# Altium schematic sheet Walrus Main.SchDoc: Main
size B; PageSetup: Record=PageOptions|CenterHorizontal=True|CenterVertical=True|PrintScale=1.05|XCorrection=1.00|YCorrection=1.00|PrintKind=2|BorderSize=5000000|LeftOffset=0|BottomOffset=0|Orientation=2|PaperLength=1000|PaperWidth=1000|Scale=100|PaperSource=7|PrintQuality=-4|MediaType=1|DitherType=10|PaperKind=Letter|PrintScaleMode=1; Organization: Morewood Design Labs, Inc.; Address1: 5001 Baum Blvd.; Address2: Suite 675; Address3: Pittsburgh, PA 15213; Address4: 412-687-1110; SheetNumber: 3; SheetTotal: 4; Client: Test; Project: {ENTER PROJECT}; MdlPcbNumber: Test; ClientPcbNumber: Test; ClientPcbaNumber: Test; ClientPcbaRev: Test; ClientPcbRev: Test; ProjectName: Walrus
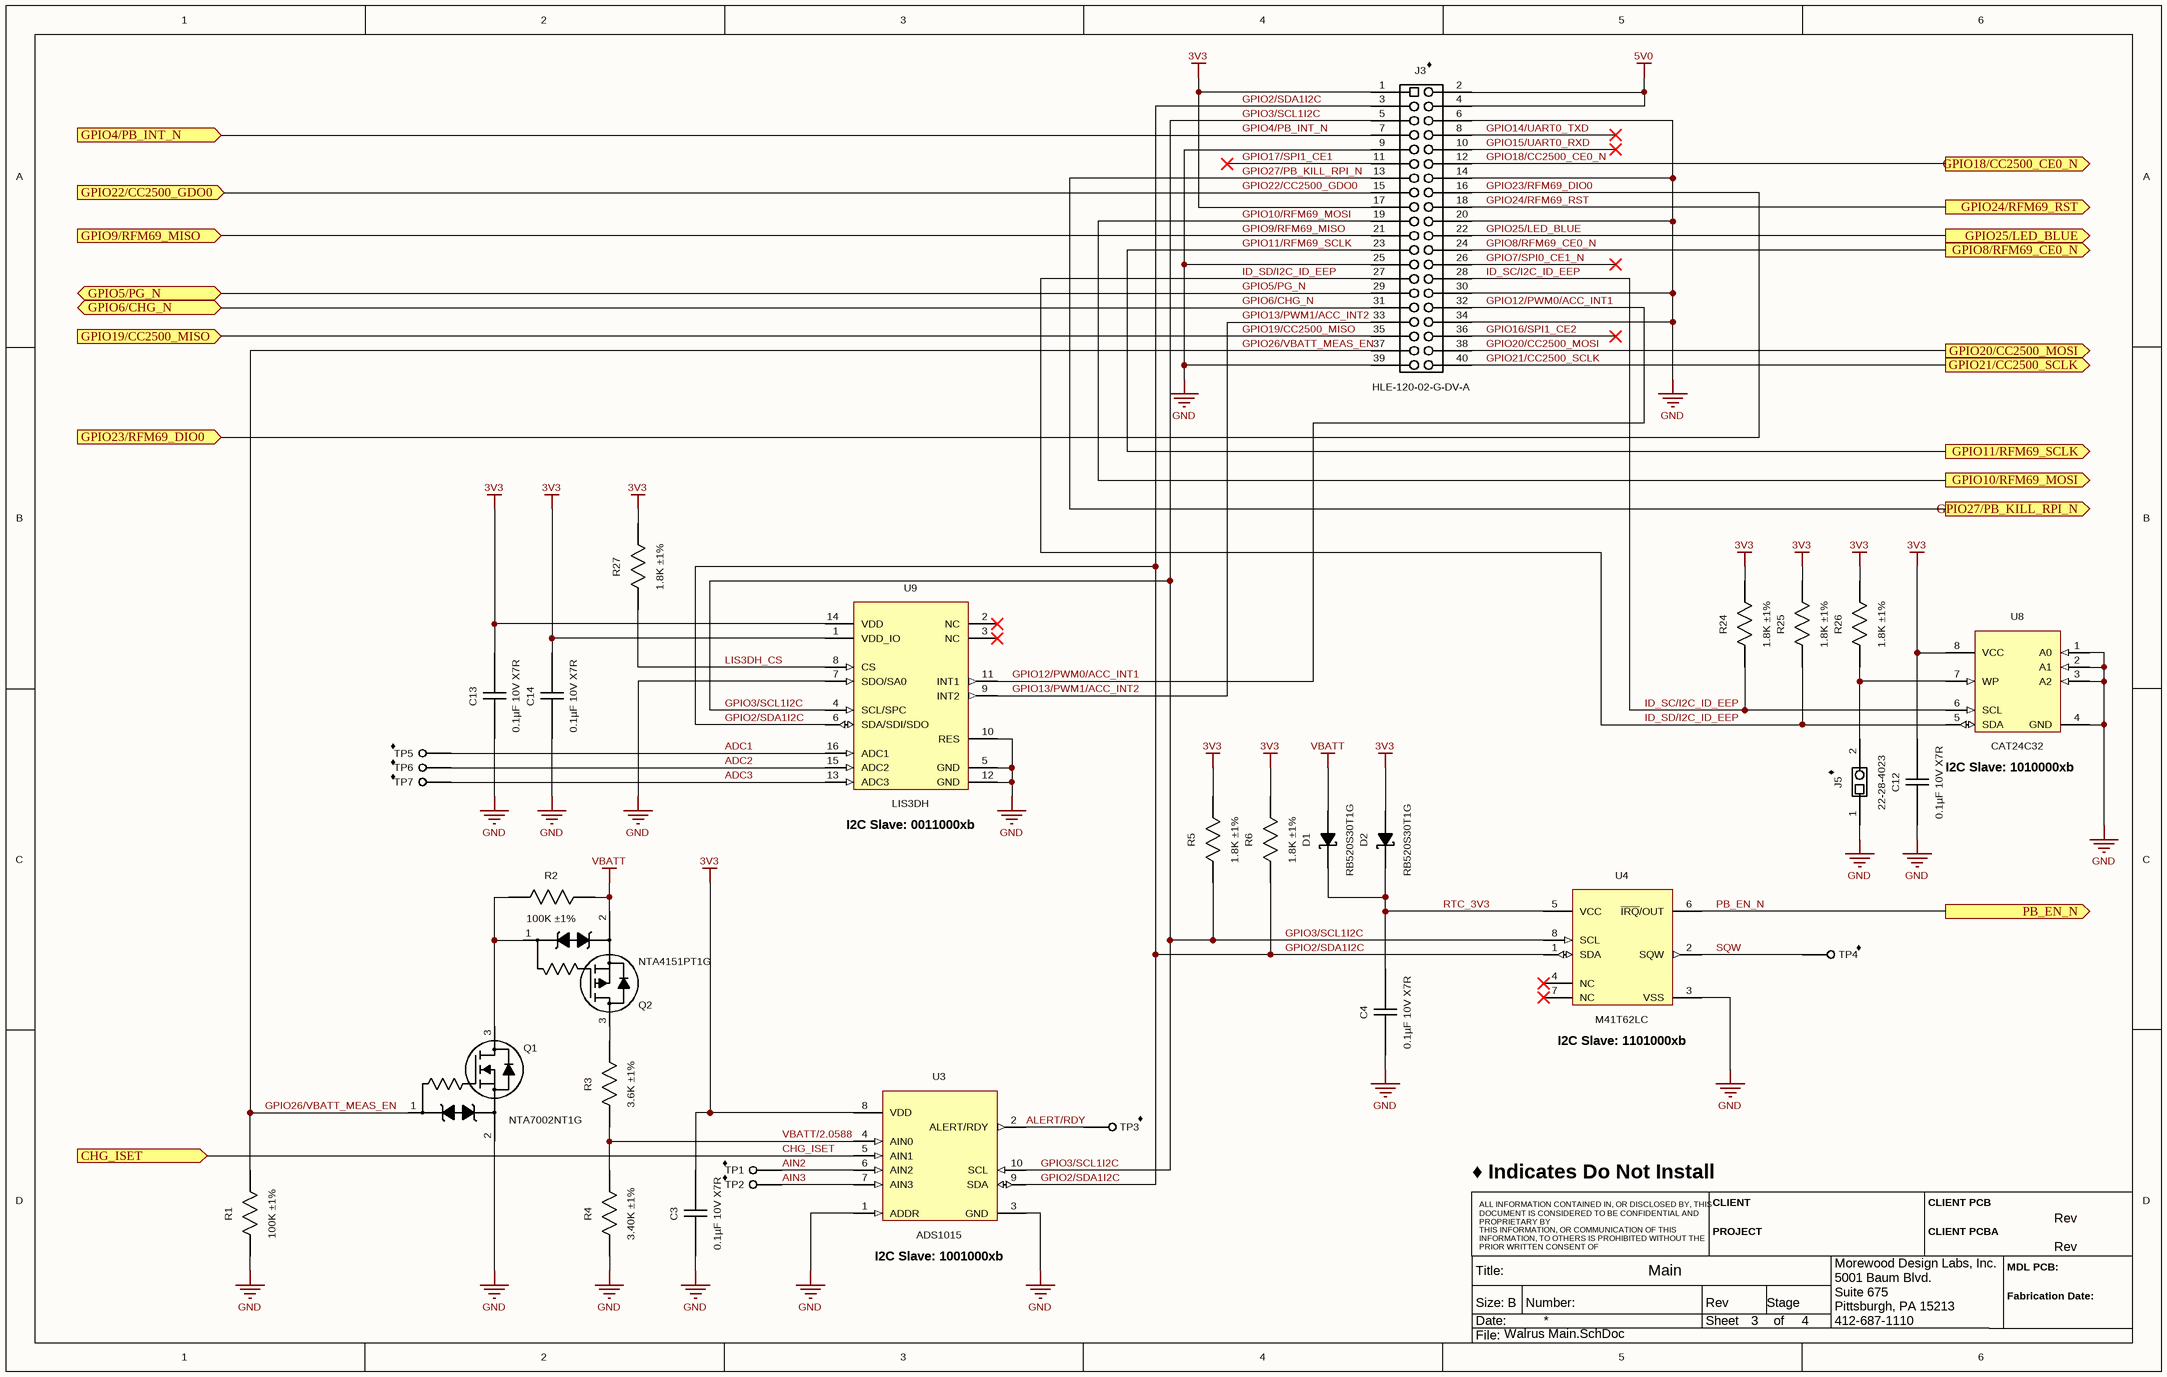
[diagram p0: Walrus Main.SchDoc]

## Parts
C3  0.1µF 10V X7R  [CAPC1005X60L(0402_FLEXTRONICS)]
C4  0.1µF 10V X7R  [CAPC1005X60L(0402_FLEXTRONICS)]
C12  0.1µF 10V X7R  [CAPC1005X60L(0402_FLEXTRONICS)]
C13  0.1µF 10V X7R  [CAPC1005X60L(0402_FLEXTRONICS)]
C14  0.1µF 10V X7R  [CAPC1005X60L(0402_FLEXTRONICS)]
D1  RB520S30T1G  [SODFL1608X70L(SOD-523)]
D2  RB520S30T1G  [SODFL1608X70L(SOD-523)]
J3  HLE-120-02-G-DV-A  DNI: ♦  [SAMTEC_HLE-120-02-G-DV-A]
J5  22-28-4023  DNI: ♦  [MOLEX_22-28-4023]
Q1  NTA7002NT1G  [SOT50P160X90-3L(SOT416, SC75)]
Q2  NTA4151PT1G  [SOT50P160X90-3L(SOT416, SC75)]
R1  100K ±1%  [RESC1005X40L(0402)]
R2  100K ±1%  [RESC1005X40L(0402)]
R3  3.6K ±1%  [RESC1005X40L(0402)]
R4  3.40K ±1%  [RESC1005X40L(0402)]
R5  1.8K ±1%  [RESC1005X40L(0402)]
R6  1.8K ±1%  [RESC1005X40L(0402)]
R24  1.8K ±1%  [RESC1005X40L(0402)]
R25  1.8K ±1%  [RESC1005X40L(0402)]
R26  1.8K ±1%  [RESC1005X40L(0402)]
R27  1.8K ±1%  [RESC1005X40L(0402)]
TP1  DNI: ♦  [TP100P50D]  (hidden comment: Test Point, Through Hole, 1.0mm Pad, 0.5mm Hole)
TP2  DNI: ♦  [TP100P50D]  (hidden comment: Test Point, Through Hole, 1.0mm Pad, 0.5mm Hole)
TP3  DNI: ♦  [TP100P50D]  (hidden comment: Test Point, Through Hole, 1.0mm Pad, 0.5mm Hole)
TP4  DNI: ♦  [TP100P50D]  (hidden comment: Test Point, Through Hole, 1.0mm Pad, 0.5mm Hole)
TP5  DNI: ♦  [TP100P50D]  (hidden comment: Test Point, Through Hole, 1.0mm Pad, 0.5mm Hole)
TP6  DNI: ♦  [TP100P50D]  (hidden comment: Test Point, Through Hole, 1.0mm Pad, 0.5mm Hole)
TP7  DNI: ♦  [TP100P50D]  (hidden comment: Test Point, Through Hole, 1.0mm Pad, 0.5mm Hole)
U3  ADS1015  [QFN50P200X150X40-10(RUG_R-PQFP-N10)]
U4  M41T62LC  [LCC90P320X150X80-8N(M41T62)]
U8  CAT24C32  [SON50P300X200X55-8L(UDFN-8)]
U9  LIS3DH  [LGA50P300X300X100-16N(LGA16)]

## Ports
CHG_ISET (in), GPIO4/PB_INT_N (in), GPIO5/PG_N (bidir), GPIO6/CHG_N (bidir), GPIO8/RFM69_CE0_N (out), GPIO9/RFM69_MISO (in), GPIO10/RFM69_MOSI (out), GPIO11/RFM69_SCLK (out), GPIO18/CC2500_CE0_N (out), GPIO19/CC2500_MISO (in), GPIO20/CC2500_MOSI (out), GPIO21/CC2500_SCLK (out), GPIO22/CC2500_GDO0 (in), GPIO23/RFM69_DIO0 (in), GPIO24/RFM69_RST (out), GPIO25/LED_BLUE (out), GPIO27/PB_KILL_RPI_N (out), PB_EN_N (out)

## Nets
3V3: C3.2 C12.2 C13.2 C14.2 D2.2(A) J3.1 J3.17 R5.2 R6.2 R24.2 R25.2 R26.2 R27.2 U3.8(VDD) U8.8(VCC) U9.1(VDD_IO) U9.14(VDD)
5V0: J3.2 J3.4
GND: C3.1 C4.1 C12.1 C13.1 C14.1 J3.6 J3.9 J3.14 J3.20 J3.25 J3.30 J3.34 J3.39 J5.1 Q1.2(S) R1.1 R4.1 U3.1(ADDR) U3.3(GND) U4.3(VSS) U8.1(A0) U8.2(A1) U8.3(A2) U8.4(GND) U9.5(GND) U9.7(SDO/SA0) U9.10(RES) U9.12(GND)
VBATT: D1.2(A) Q2.2(S) R2.2
ADC1: TP5.1 U9.16(ADC1)
ADC2: TP6.1 U9.15(ADC2)
ADC3: TP7.1 U9.13(ADC3)
AIN2: TP1.1 U3.6(AIN2)
AIN3: TP2.1 U3.7(AIN3)
ALERT/RDY: TP3.1 U3.2(ALERT/RDY)
CHG_ISET: U3.5(AIN1) ; port CHG_ISET
GPIO2/SDA1I2C: J3.3 R6.1 U3.9(SDA) U4.1(SDA) U9.6(SDA/SDI/SDO)
GPIO3/SCL1I2C: J3.5 R5.1 U3.10(SCL) U4.8(SCL) U9.4(SCL/SPC)
GPIO4/PB_INT_N: J3.7 ; port GPIO4/PB_INT_N
GPIO5/PG_N: J3.29 ; port GPIO5/PG_N
GPIO6/CHG_N: J3.31 ; port GPIO6/CHG_N
GPIO7/SPI0_CE1_N: J3.26
GPIO8/RFM69_CE0_N: J3.24 ; port GPIO8/RFM69_CE0_N
GPIO9/RFM69_MISO: J3.21 ; port GPIO9/RFM69_MISO
GPIO10/RFM69_MOSI: J3.19 ; port GPIO10/RFM69_MOSI
GPIO11/RFM69_SCLK: J3.23 ; port GPIO11/RFM69_SCLK
GPIO12/PWM0/ACC_INT1: J3.32 U9.11(INT1)
GPIO13/PWM1/ACC_INT2: J3.33 U9.9(INT2)
GPIO14/UART0_TXD: J3.8
GPIO15/UART0_RXD: J3.10
GPIO16/SPI1_CE2: J3.36
GPIO17/SPI1_CE1: J3.11
GPIO18/CC2500_CE0_N: J3.12 ; port GPIO18/CC2500_CE0_N
GPIO19/CC2500_MISO: J3.35 ; port GPIO19/CC2500_MISO
GPIO20/CC2500_MOSI: J3.38 ; port GPIO20/CC2500_MOSI
GPIO21/CC2500_SCLK: J3.40 ; port GPIO21/CC2500_SCLK
GPIO22/CC2500_GDO0: J3.15 ; port GPIO22/CC2500_GDO0
GPIO23/RFM69_DIO0: J3.16 ; port GPIO23/RFM69_DIO0
GPIO24/RFM69_RST: J3.18 ; port GPIO24/RFM69_RST
GPIO25/LED_BLUE: J3.22 ; port GPIO25/LED_BLUE
GPIO26/VBATT_MEAS_EN: J3.37 Q1.1(G) R1.2
GPIO27/PB_KILL_RPI_N: J3.13 ; port GPIO27/PB_KILL_RPI_N
ID_SC/I2C_ID_EEP: J3.28 R24.1 U8.6(SCL)
ID_SD/I2C_ID_EEP: J3.27 R25.1 U8.5(SDA)
LIS3DH_CS: R27.1 U9.8(CS)
PB_EN_N: U4.6(~{IRQ}/OUT) ; port PB_EN_N
RTC_3V3: C4.2 D1.1(K) D2.1(K) U4.5(VCC)
SQW: TP4.1 U4.2(SQW)
VBATT/2.0588: R3.1 R4.2 U3.4(AIN0)
NetJ5_2: J5.2 R26.1 U8.7(WP)
NetQ1_3: Q1.3(D) Q2.1(G) R2.1
NetQ2_3: Q2.3(D) R3.2

Not connected (* = marked no-connect by the designer): U4 4(NC)* 7(NC)*; U9 2(NC)* 3(NC)*

## Notes on the sheet
- (near U9) I2C Slave: 0011000xb
- I2C Slave: 1010000xb
- (near U4) I2C Slave: 1101000xb
- ♦ Indicates Do Not Install
- (near U3) I2C Slave: 1001000xb
- ALL INFORMATION CONTAINED IN, OR DISCLOSED BY, THIS DOCUMENT IS CONSIDERED TO BE CONFIDENTIAL AND PROPRIETARY BY
- THIS INFORMATION, OR COMMUNICATION OF THIS INFORMATION, TO OTHERS IS PROHIBITED WITHOUT THE PRIOR WRITTEN CONSENT OF
- CLIENT
- PROJECT
- CLIENT PCB
- CLIENT PCBA
- MDL PCB:
- Rev
- Title:
- Size:
- Date:
- B
- Number:
- Sheet
- Stage
- of
- Fabrication Date:
- File:

## Library data of the parts
C3 C4 C12-C14 = CAP_000208: Ceramic Chip Capacitor; Mfg1PartNumber: GRM155R71A104KA01D; Tolerance: ±10%; Mfg1: Murata; MDLPartNumber: CAP_000208; Value: 0.1µF; Dielectric: Ceramic; Voltage: 10V; Mounting: SMT; Case: 1005(0402); Height: 0.55mm(21.7mils); Tempco: X7R; OperatingTemp: -55C to 125C; CreationDate: 5/29/2017; Creator: R. Casciola; LeadFree: True; RoHS: True; Packaging: T&R; ComponentLink1Description: Mfg1 Datasheet; ComponentLink1URL: http://search.murata.co.jp/Ceramy/image/img/A01X/G101/ENG/GRM155R71A104KA01-01.pdf; Distributor: https://www.digikey.com/product-detail/en/murata-electronics-north-america/GRM155R71A104KA01D/490-6321-1-ND/3845518
D1 D2 = DIOD_000001: Schottky Barrier Diode; MaxReverseVoltage: 30V; MaxForwardCurrent (mA): 200mA; MaxReverseLeakage: 1.0µA; MaxForwardVoltage: 0.60V@200mA; Mfg1: ON Seminconductor; MDLPartNumber: DIOD_000001; Type: Schottky; Mounting: SMT; Pins: 2; Case: SOD-523; Height: 0.70mm(27.6mils); CreationDate: 4/7/2010; Creator: R. Casciola; LeadFree: True; RoHS: True; Packaging: T&R; Mfg1PartNumber: RB520S30T1G; ComponentLink1Description: Mfg1 Datasheet; ComponentLink1URL: http://www.onsemi.com/pub_link/Collateral/RB520S30T1-D.PDF; Distributor: https://www.digikey.com/product-detail/en/on-semiconductor/RB520S30T1G/RB520S30T1GOSCT-ND/964626
J3 = CONN_000192: 0.100" Tiger Beam™ Cost-effective Single Beam Socket Strip; Mfg1: Samtec; MDLPartNumber: CONN_000192; Mounting: SMT; Height: 3.66mm; CreationDate: 7/27/2017; Creator: R. Casciola; LeadFree: True; RoHS: True; Mfg1PartNumber: HLE-120-02-G-DV-A; ComponentLink1Description: Mfg1 Datasheet; ComponentLink1URL: http://suddendocs.samtec.com/catalog_english/hle.pdf
J5 = CONN_000017: KK 100 HEADER ASSY FLAT VERTICAL BREAKAWAY, 1X2; Mfg2PartNumber: TSW-102-07-T-S; BBTPartNumber: 100240; Modifer: R. Casciola; Mfg1: Molex; MDLPartNumber: CONN_000017; Mounting: Through Hole; Height: 8.38mm; CreationDate: 7/23/2010; Creator: R. Casciola; ModificationDate: 9/21/2010; LeadFree: True; RoHS: True; Mfg1PartNumber: 22-28-4023; ComponentLink1Description: Mfg1 Datasheet; ComponentLink1URL: http://www.molex.com/pdm_docs/sd/022284023_sd.pdf; Mfg2: Samtec; ComponentLink2Description: Mfg2 Datasheet; ComponentLink2URL: http://www.samtec.com/documents/webfiles/pdf/TSW_TH.PDF
Q1 = TRAN_000002: Small Signal MOSFET; Type: MOSFET, N-Channel, Single; MaxVdss: 30V; MaxVgs: ±10V; MaxContinuousDrainCurrent: 154mA; MaxPowerDissipation: 300mW; OperatingJunctionTemperatureRange: -55C to 150C; Modifer: R. Casciola; Mfg1: ON Seminconductor; MDLPartNumber: TRAN_000002; Mounting: SMT; Pins: 3; Case: SOT416, SC75; Height: 0.90mm(35.4mils); CreationDate: 4/8/2010; Creator: R. Casciola; ModificationDate: 5/4/2012; LeadFree: True; RoHS: True; Packaging: T&R; Mfg1PartNumber: NTA7002NT1G; ComponentLink1Description: Mfg1 Datasheet; ComponentLink1URL: http://www.onsemi.com/pub_link/Collateral/NTA7002N-D.PDF; Distributor: https://www.digikey.com/product-detail/en/on-semiconductor/NTA7002NT1G/NTA7002NT1GOSCT-ND/1484663
Q2 = TRAN_000001: Small Signal MOSFET; Type: MOSFET, P-Channel, Single; MaxVdss: -20V; MaxVgs: ±6V; MaxContinuousDrainCurrent: -760mA; MaxPowerDissipation: 301mW; OperatingJunctionTemperatureRange: -55C to 150C; Mfg1: ON Seminconductor; MDLPartNumber: TRAN_000001; Mounting: SMT; Pins: 3; Case: SOT416, SC75; Height: 0.90mm(35.4mils); CreationDate: 4/8/2010; Creator: R. Casciola; LeadFree: True; RoHS: True; Packaging: T&R; Mfg1PartNumber: NTA4151PT1G; ComponentLink1Description: Mfg1 Datasheet; ComponentLink1URL: http://www.onsemi.com/pub_link/Collateral/NTA4151P-D.PDF; Distributor: https://www.digikey.com/product-detail/en/on-semiconductor/NTA4151PT1G/NTA4151PT1GOSCT-ND/687112
R1 R2 = RES_000067: Chip Resistor, Thick Film; Mfg1PartNumber: CRCW0402100KFKED; Power: 0.063W; LE Voltage: 50V; Tempco: ±100ppm/C; Mfg1: Vishay/Dale; DNI: *; MDLPartNumber: RES_000067; Value: 100K; Tolerance: ±1%; Mounting: SMT; Case: 1005(0402); Height: 0.40mm(15.7mils); Composition: Thick Film; OperatingTemp: -55C to 155C; CreationDate: 12/22/2010; Creator: R. Casciola; LeadFree: True; RoHS: True; Packaging: T&R; ComponentLink1Description: Mfg1 Datasheet; ComponentLink1URL: http://www.vishay.com/docs/20035/dcrcwe3.pdf; Distributor: https://www.digikey.com/product-detail/en/vishay-dale/CRCW0402100KFKED/541-100KLCT-ND/1183351
R3 = RES_000296: Chip Resistor, Thick Film; Mfg1PartNumber: CRCW04023K60FKED; Power: 0.063W; LE Voltage: 50V; Tempco: ±100ppm/C; Mfg1: Vishay/Dale; DNI: *; MDLPartNumber: RES_000296; Value: 3.6K; Tolerance: ±1%; Mounting: SMT; Case: 1005(0402); Height: 0.40mm(15.7mils); Composition: Thick Film; OperatingTemp: -55C to 155C; CreationDate: 8/22/2017; Creator: R. Casciola; LeadFree: True; RoHS: True; Packaging: T&R; ComponentLink1Description: Mfg1 Datasheet; ComponentLink1URL: http://www.vishay.com/docs/20035/dcrcwe3.pdf; Distributor: https://www.digikey.com/product-detail/en/vishay-dale/CRCW04023K60FKED/541-3.60KLCT-ND/1183185
R4 = RES_000253: Chip Resistor, Thick Film; Mfg1PartNumber: CRCW04023K40FKED; Power: 0.063W; LE Voltage: 50V; Tempco: ±100ppm/C; Mfg1: Vishay/Dale; DNI: *; MDLPartNumber: RES_000253; Value: 3.40K; Tolerance: ±1%; Mounting: SMT; Case: 1005(0402); Height: 0.40mm(15.7mils); Composition: Thick Film; OperatingTemp: -55C to 155C; CreationDate: 2/18/2015; Creator: R. Casciola; LeadFree: True; RoHS: True; Packaging: T&R; ComponentLink1Description: Mfg1 Datasheet; ComponentLink1URL: http://www.vishay.com/docs/20035/dcrcwe3.pdf; Distributor: https://www.digikey.com/product-detail/en/vishay-dale/CRCW04023K40FKED/541-3.40KLCT-ND/1183182
R5 R6 R24-R27 = RES_000288: Chip Resistor, Thick Film; Mfg1PartNumber: CRCW04021K80FKED; Mfg2PartNumber: RC0402FR-071K8L; Power: 0.063W; LE Voltage: 50V; Tempco: ±100ppm/°C; Mfg1: Vishay/Dale; DNI: *; MDLPartNumber: RES_000288; Value: 1.8K; Tolerance: ±1%; Mounting: SMT; Case: 1005(0402); Height: 0.40mm(15.7mils); Composition: Thick Film; OperatingTemp: -55C to 155C; CreationDate: 7/23/2017; Creator: R. Casciola; LeadFree: True; RoHS: True; Packaging: T&R; ComponentLink1Description: Mfg1 Datasheet; ComponentLink1URL: http://www.vishay.com/docs/20035/dcrcwe3.pdf; ComponentLink2Description: Mfg2 Datasheet; ComponentLink2URL: http://www.yageo.com/NewPortal/yageodocoutput?fileName=/pdf/R-Chip/PYu-RC_Group_51_RoHS_L_5.pdf; Mfg2: Yageo; Distributor: https://www.digikey.com/product-detail/en/vishay-dale/CRCW04021K80FKED/541-1.80KLCT-ND/1183150
TP1-TP7 = TP_000015: Test Point; MDLPartNumber: TP_000015; CreationDate: 11/16/2010; Creator: R. Casciola; LeadFree: True; RoHS: True
U3 = IC_000284: Ultra-Small, Low-Power, I2C-Compatible, 3.3-kSPS, 12-Bit ADC With Internal Reference, Oscillator, and Programmable Comparator; PartMarking: N7J; Mfg1PartNumber: ADS1015IRUGR,ADS1015IRUGT; Mfg1: Texas Instruments; MDLPartNumber: IC_000284; Mounting: SMT; Pins: 10; Case: X2QFN; Height: 0.40mm(15.7mils); OperatingTemp: -40C to 85C; CreationDate: 5/27/2017; Creator: R. Casciola; LeadFree: True; RoHS: True; Packaging: T&R; ComponentLink1Description: Mfg1 Datasheet; ComponentLink1URL: http://www.ti.com/lit/ds/symlink/ads1013.pdf; Distributor: https://www.digikey.com/product-detail/en/texas-instruments/ADS1015IRUGR/296-43557-1-ND/5864781
U4 = IC_000295: Low-power serial real-time clock (RTCs) with alarm; Mfg1PartNumber: M41T62LC6F; Mfg1: STMicroelectronics; MDLPartNumber: IC_000295; Mounting: SMT; Pins: 8; Case: LCC-8; Height: 0.80mm(31.5mils); OperatingTemp: -40C to 85C; CreationDate: 7/23/2017; Creator: R. Casciola; LeadFree: True; RoHS: True; Packaging: T&R; ComponentLink1Description: Mfg1 Datasheet; ComponentLink1URL: http://www.st.com/content/ccc/resource/technical/document/datasheet/c8/66/38/71/c4/ac/49/9e/CD00019860.pdf/files/CD00019860.pdf/jcr:content/translations/en.CD00019860.pdf; Distributor: https://www.digikey.com/product-detail/en/stmicroelectronics/M41T62LC6F/497-11275-1-ND/2673274
U8 = IC_000300: 32-Kb I2C CMOS Serial EEPROM; Mfg1PartNumber: CAT24C32HU4I-GT3; Mfg1: ON Seminconductor; Modifer: R. Casciola; MDLPartNumber: IC_000300; Mounting: SMT; Pins: 8; Case: UDFN-8; Height: 0.55mm(21.7mils); OperatingTemp: -40C to 85C; CreationDate: 8/2/2017; Creator: R. Casciola; LeadFree: True; RoHS: True; Packaging: T&R; ComponentLink1Description: Mfg1 Datasheet; ComponentLink1URL: http://www.onsemi.com/pub/Collateral/CAT24C32-D.PDF; Distributor: https://www.digikey.com/product-detail/en/on-semiconductor/CAT24C32HU4I-GT3/CAT24C32HU4I-GT3OSCT-ND/4927901; ModificationDate: 8/24/2017
U9 = IC_000038: MEMS digital output motion sensor: ultra low-power high performance 3-axes “nano” accelerometer; Mfg1PartNumber: LIS3DHTR; Mfg1: STMicroelectronics; Modifer: R. Casciola; MDLPartNumber: IC_000038; Mounting: SMT; Pins: 16; Case: LGA-16; Height: 1.00mm(39.4mils); OperatingTemp: -40C to 85C; CreationDate: 11/8/2010; Creator: R. Casciola; LeadFree: True; RoHS: True; Packaging: TRAY; ComponentLink1Description: Mfg1 Datasheet; ComponentLink1URL: http://www.st.com/internet/com/TECHNICAL_RESOURCES/TECHNICAL_LITERATURE/DATASHEET/CD00274221.pdf; Distributor: https://www.digikey.com/product-detail/en/stmicroelectronics/LIS3DHTR/497-10613-1-ND/2334355; ModificationDate: 8/24/2017